# Altium schematic sheet EEPROM.SchDoc: Title
size A4; Project: Q24 VCU; ENG_APP_DATE: --/--/--; DSN_APP_DATE: --/--/--; CHK_APP_DATE: --/--/--; Date: *******; ApprovedBy: *******; CheckedBy: None; Author: *******; CompanyName: *******; DrawnBy: Jacob Chisholm; Engineer: *******; Organization: *******; Address1: *******; Address2: *******; Address3: *******; Address4: *******; DocumentNumber: 4; Revision: *******; SheetNumber: 4; SheetTotal: 14; Address_Website: https://jchisholm204.github.io; E-Mail: JacobChisholm1010@gmail.com; CurrentTime: *******; CurrentDate: *******; Time: *******; DocumentFullPathAndName: *******; DocumentName: *******; ModifiedDate: *******; ImagePath: *******; ProjectName: *******; Application_BuildNumber: *******
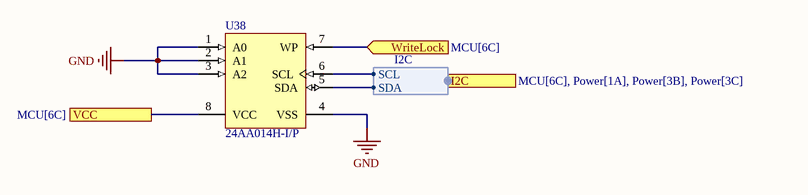
[diagram p0: EEPROM.SchDoc]

## Parts
U38  24AA014H-I/P  [PDIP300-P8]

## Ports
I2C (harness I2C, see MCU[6C], Power[1A], Power[3B], Power[3C]), VCC (see MCU[6C]), WriteLock (in, see MCU[6C])

## Harnesses
I2C: SDA, SCL

## Nets
GND: U38.1(A0) U38.2(A1) U38.3(A2) U38.4(VSS)
VCC: U38.8(VCC) ; port VCC
WriteLock: U38.7(WP) ; port WriteLock
NetU38_5: U38.5(SDA) ; port I2C.SDA
NetU38_6: U38.6(SCL) ; port I2C.SCL

## Notes on the sheet
- Title:
- Drawn By:
- Page Contents:
- Checked By:
- Size:
- Date:
- File:
- License:
- Email:
- A4
- Number:
- Time:
- Revision:
- Sheet
- Website:
- of

## Library data of the parts
U38 = CMP-0159-00110-1: 1Kbit, 400kHz, 1.7V, I2C Addressable Serial EEPROM, 8-Pin PDIP, Industrial Temperature; PackageDescription: 8-Lead Plastic Dual In-Line (P) - 300 mil Body [PDIP]; Code_JEDEC: MS-001; PackageReference: PDIP300-P8; DatasheetVersion: revB, Sep-2008; PackageVersion: revBB, Aug-2009